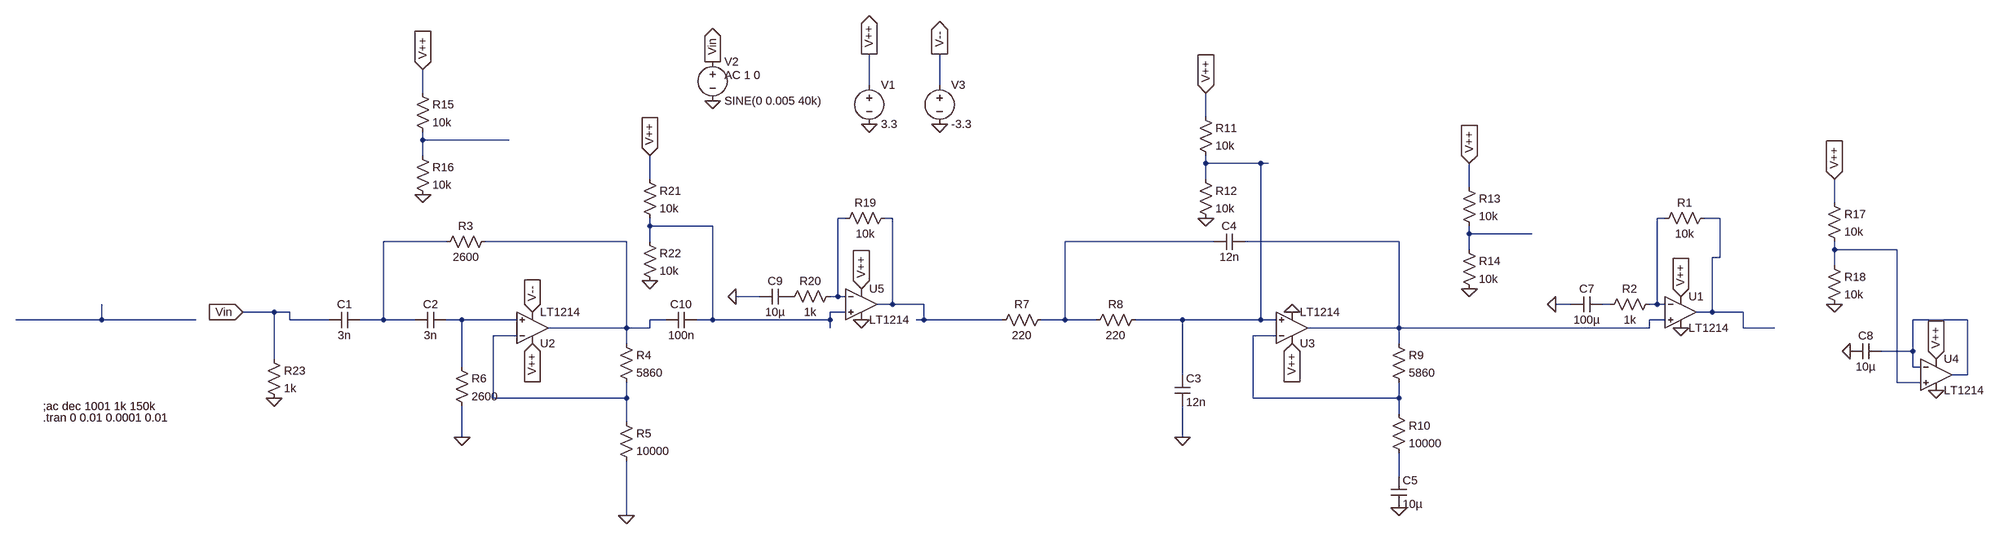
[diagram p0: schematic RxNew3.asc]
RxNew3.asc, the LTspice schematic file:
Version 4
SHEET 1 5304 680
WIRE 2528 -464 2528 -528
WIRE 2672 -464 2672 -528
WIRE 1616 -448 1616 -496
WIRE 3216 -400 3216 -448
WIRE 1616 -352 1616 -368
WIRE 1792 -352 1616 -352
WIRE 1616 -320 1616 -352
WIRE 3216 -304 3216 -320
WIRE 3328 -304 3216 -304
WIRE 3344 -304 3328 -304
WIRE 2080 -272 2080 -320
WIRE 3216 -272 3216 -304
WIRE 3776 -256 3776 -304
WIRE 4992 -224 4992 -272
WIRE 2480 -192 2464 -192
WIRE 2576 -192 2560 -192
WIRE 4176 -192 4160 -192
WIRE 4288 -192 4256 -192
WIRE 2080 -176 2080 -192
WIRE 2208 -176 2080 -176
WIRE 3776 -160 3776 -176
WIRE 3904 -160 3776 -160
WIRE 1664 -144 1536 -144
WIRE 2032 -144 1744 -144
WIRE 2080 -144 2080 -176
WIRE 3232 -144 2928 -144
WIRE 3632 -144 3296 -144
WIRE 3776 -128 3776 -160
WIRE 4992 -128 4992 -144
WIRE 5120 -128 4992 -128
WIRE 4288 -112 4288 -192
WIRE 4288 -112 4272 -112
WIRE 4992 -96 4992 -128
WIRE 2304 -32 2256 -32
WIRE 2464 -32 2464 -192
WIRE 2464 -32 2448 -32
WIRE 2480 -32 2464 -32
WIRE 2576 -16 2576 -192
WIRE 2576 -16 2544 -16
WIRE 2640 -16 2576 -16
WIRE 3984 -16 3952 -16
WIRE 4064 -16 4048 -16
WIRE 4160 -16 4160 -192
WIRE 4160 -16 4144 -16
WIRE 4176 -16 4160 -16
WIRE 1312 0 1248 0
WIRE 1344 0 1312 0
WIRE 2480 0 2448 0
WIRE 4272 0 4272 -112
WIRE 4272 0 4240 0
WIRE 4336 0 4272 0
WIRE 960 16 960 -16
WIRE 960 16 784 16
WIRE 1152 16 960 16
WIRE 1344 16 1344 0
WIRE 1424 16 1344 16
WIRE 1536 16 1536 -144
WIRE 1536 16 1488 16
WIRE 1600 16 1536 16
WIRE 1696 16 1664 16
WIRE 1808 16 1696 16
WIRE 2112 16 2080 16
WIRE 2208 16 2208 -176
WIRE 2208 16 2176 16
WIRE 2448 16 2448 0
WIRE 2448 16 2208 16
WIRE 2640 16 2640 -16
WIRE 2640 16 2624 16
WIRE 2800 16 2640 16
WIRE 2928 16 2928 -144
WIRE 2928 16 2880 16
WIRE 2992 16 2928 16
WIRE 3168 16 3072 16
WIRE 3328 16 3328 -304
WIRE 3328 16 3168 16
WIRE 3360 16 3328 16
WIRE 4176 16 4144 16
WIRE 5264 16 5152 16
WIRE 2032 32 2032 -144
WIRE 2032 32 1872 32
WIRE 2080 32 2080 16
WIRE 2080 32 2032 32
WIRE 2448 32 2448 16
WIRE 3632 32 3632 -144
WIRE 3632 32 3424 32
WIRE 4144 32 4144 16
WIRE 4144 32 3632 32
WIRE 4336 32 4336 0
WIRE 4400 32 4336 32
WIRE 1808 48 1760 48
WIRE 3360 48 3312 48
WIRE 2032 64 2032 32
WIRE 3632 64 3632 32
WIRE 5152 80 5152 16
WIRE 5152 80 5088 80
WIRE 1312 96 1312 0
WIRE 1696 112 1696 16
WIRE 5152 112 5152 80
WIRE 5168 112 5152 112
WIRE 3168 128 3168 16
WIRE 5264 128 5264 16
WIRE 5264 128 5232 128
WIRE 5120 144 5120 -128
WIRE 5168 144 5120 144
WIRE 1760 176 1760 48
WIRE 2032 176 2032 144
WIRE 2032 176 1760 176
WIRE 3312 176 3312 48
WIRE 3632 176 3632 144
WIRE 3632 176 3312 176
WIRE 3632 208 3632 176
WIRE 2032 224 2032 176
WIRE 1696 256 1696 192
WIRE 3168 256 3168 192
WIRE 3632 336 3632 288
WIRE 2032 416 2032 304
FLAG 3952 -16 0
FLAG 4208 -32 V++
IOPIN 4208 -32 In
FLAG 1696 256 0
FLAG 3168 256 0
FLAG 5200 96 V++
IOPIN 5200 96 In
FLAG 1248 0 Vin
IOPIN 1248 0 In
FLAG 2528 -384 0
FLAG 2528 -528 V++
IOPIN 2528 -528 Out
FLAG 2208 -432 0
FLAG 2208 -512 Vin
IOPIN 2208 -512 Out
FLAG 3776 -304 V++
IOPIN 3776 -304 In
FLAG 3776 -48 0
FLAG 4208 32 0
FLAG 5200 160 0
FLAG 1616 -496 V++
IOPIN 1616 -496 In
FLAG 1616 -240 0
FLAG 3632 400 0
FLAG 3392 64 V++
IOPIN 3392 64 In
FLAG 1840 64 V++
IOPIN 1840 64 In
FLAG 3392 0 0
FLAG 2032 416 0
FLAG 3216 -448 V++
IOPIN 3216 -448 In
FLAG 3216 -192 0
FLAG 1840 0 V--
IOPIN 1840 0 In
FLAG 2672 -384 0
FLAG 2672 -528 V--
IOPIN 2672 -528 Out
FLAG 4992 -272 V++
IOPIN 4992 -272 In
FLAG 4992 -16 0
FLAG 5024 80 0
FLAG 2256 -32 0
FLAG 2512 -48 V++
IOPIN 2512 -48 In
FLAG 2080 -320 V++
IOPIN 2080 -320 In
FLAG 2080 -64 0
FLAG 2512 16 0
FLAG 1312 176 0
SYMBOL Opamps\\LT1214 4208 -64 R0
SYMATTR InstName U1
SYMBOL res 4160 -32 R90
WINDOW 0 0 56 VBottom 2
WINDOW 3 32 56 VTop 2
SYMATTR InstName R2
SYMATTR Value 1k
SYMBOL cap 1488 0 R90
WINDOW 0 0 32 VBottom 2
WINDOW 3 32 32 VTop 2
SYMATTR InstName C1
SYMATTR Value 3n
SYMBOL cap 1664 0 R90
WINDOW 0 0 32 VBottom 2
WINDOW 3 32 32 VTop 2
SYMATTR InstName C2
SYMATTR Value 3n
SYMBOL Opamps\\LT1214 1840 96 M180
SYMATTR InstName U2
SYMBOL res 1760 -160 R90
WINDOW 0 0 56 VBottom 2
WINDOW 3 32 56 VTop 2
SYMATTR InstName R3
SYMATTR Value 2600
SYMBOL res 2016 48 R0
SYMATTR InstName R4
SYMATTR Value 5860
SYMBOL res 2016 208 R0
SYMATTR InstName R5
SYMATTR Value 10000
SYMBOL res 1680 96 R0
SYMATTR InstName R6
SYMATTR Value 2600
SYMBOL res 2896 0 R90
WINDOW 0 0 56 VBottom 2
WINDOW 3 32 56 VTop 2
SYMATTR InstName R7
SYMATTR Value 220
SYMBOL res 3088 0 R90
WINDOW 0 0 56 VBottom 2
WINDOW 3 32 56 VTop 2
SYMATTR InstName R8
SYMATTR Value 220
SYMBOL cap 3152 128 R0
SYMATTR InstName C3
SYMATTR Value 12n
SYMBOL cap 3296 -160 R90
WINDOW 0 0 32 VBottom 2
WINDOW 3 32 32 VTop 2
SYMATTR InstName C4
SYMATTR Value 12n
SYMBOL Opamps\\LT1214 3392 96 M180
SYMATTR InstName U3
SYMBOL res 3616 48 R0
SYMATTR InstName R9
SYMATTR Value 5860
SYMBOL res 3616 192 R0
SYMATTR InstName R10
SYMATTR Value 10000
SYMBOL Opamps\\LT1214 5200 64 R0
SYMATTR InstName U4
SYMBOL voltage 2528 -480 R0
WINDOW 123 0 0 Left 0
WINDOW 39 0 0 Left 0
SYMATTR InstName V1
SYMATTR Value 3.3
SYMBOL voltage 2208 -528 R0
WINDOW 123 24 44 Left 2
WINDOW 39 0 0 Left 0
SYMATTR Value2 AC 1 0
SYMATTR InstName V2
SYMATTR Value SINE(0 0.005 40k)
SYMBOL res 3760 -272 R0
SYMATTR InstName R13
SYMATTR Value 10k
SYMBOL res 3760 -144 R0
SYMATTR InstName R14
SYMATTR Value 10k
SYMBOL res 1600 -464 R0
SYMATTR InstName R15
SYMATTR Value 10k
SYMBOL res 1600 -336 R0
SYMATTR InstName R16
SYMATTR Value 10k
SYMBOL res 3200 -416 R0
SYMATTR InstName R11
SYMATTR Value 10k
SYMBOL res 3200 -288 R0
SYMATTR InstName R12
SYMATTR Value 10k
SYMBOL cap 3616 336 R0
SYMATTR InstName C5
SYMATTR Value 10µ
SYMBOL voltage 2672 -480 R0
WINDOW 123 0 0 Left 0
WINDOW 39 0 0 Left 0
SYMATTR InstName V3
SYMATTR Value -3.3
SYMBOL res 4976 -240 R0
SYMATTR InstName R17
SYMATTR Value 10k
SYMBOL res 4976 -112 R0
SYMATTR InstName R18
SYMATTR Value 10k
SYMBOL cap 5088 64 R90
WINDOW 0 0 32 VBottom 2
WINDOW 3 32 32 VTop 2
SYMATTR InstName C8
SYMATTR Value 10µ
SYMBOL Opamps\\LT1214 2512 -80 R0
SYMATTR InstName U5
SYMBOL res 2464 -48 R90
WINDOW 0 0 56 VBottom 2
WINDOW 3 32 56 VTop 2
SYMATTR InstName R20
SYMATTR Value 1k
SYMBOL res 2064 -288 R0
SYMATTR InstName R21
SYMATTR Value 10k
SYMBOL res 2064 -160 R0
SYMATTR InstName R22
SYMATTR Value 10k
SYMBOL cap 2368 -48 R90
WINDOW 0 0 32 VBottom 2
WINDOW 3 32 32 VTop 2
SYMATTR InstName C9
SYMATTR Value 10µ
SYMBOL cap 2176 0 R90
WINDOW 0 0 32 VBottom 2
WINDOW 3 32 32 VTop 2
SYMATTR InstName C10
SYMATTR Value 100n
SYMBOL cap 4048 -32 R90
WINDOW 0 0 32 VBottom 2
WINDOW 3 32 32 VTop 2
SYMATTR InstName C7
SYMATTR Value 100µ
SYMBOL res 2576 -208 R90
WINDOW 0 0 56 VBottom 2
WINDOW 3 32 56 VTop 2
SYMATTR InstName R19
SYMATTR Value 10k
SYMBOL res 4272 -208 R90
WINDOW 0 0 56 VBottom 2
WINDOW 3 32 56 VTop 2
SYMATTR InstName R1
SYMATTR Value 10k
SYMBOL res 1296 80 R0
SYMATTR InstName R23
SYMATTR Value 1k
TEXT 840 192 Left 2 !;ac dec 1001 1k 150k
TEXT 840 216 Left 2 !.tran 0 0.01 0.0001 0.01

The netlist it stands for:
* RxNew3.asc
XU1 N012 N005 V++ 0 N006 LT1213  ; LT1214, pins In+ In- V+ V- OUT
R2 N005 N014 1k
C1 N009 Vin 3n
C2 N016 N009 3n
XU2 N016 N018 V++ V-- N010 LT1213  ; LT1214, pins In+ In- V+ V- OUT
R3 N010 N009 2600
R4 N010 N018 5860
R5 N018 0 10000
R6 N016 0 2600
R7 N011 N004 220
R8 N002 N011 220
C3 N002 0 12n
C4 N012 N011 12n
XU3 N002 N019 V++ 0 N012 LT1213  ; LT1214, pins In+ In- V+ V- OUT
R9 N012 N019 5860
R10 N019 N020 10000
XU4 N013 N017 V++ 0 N017 LT1213  ; LT1214, pins In+ In- V+ V- OUT
V1 V++ 0 3.3
V2 Vin 0 SINE(0 0.005 40k) AC 1 0
R13 V++ N008 10k
R14 N008 0 10k
R15 V++ N001 10k
R16 N001 0 10k
R11 V++ N002 10k
R12 N002 0 10k
C5 N020 0 10µ
V3 V-- 0 -3.3
R17 V++ N013 10k
R18 N013 0 10k
C8 N017 0 10µ
XU5 N007 N003 V++ 0 N004 LT1213  ; LT1214, pins In+ In- V+ V- OUT
R20 N003 P001 1k
R21 V++ N007 10k
R22 N007 0 10k
C9 P001 0 10µ
C10 N007 N010 100n
C7 N014 0 100µ
R19 N004 N003 10k
R1 N006 N005 10k
R23 Vin 0 1k
;ac dec 1001 1k 150k
.tran 0 0.01 0.0001 0.01
.lib LTC.lib
.backanno
.end